# EAGLE schematic ts808 (EAGLE 8.2.0)
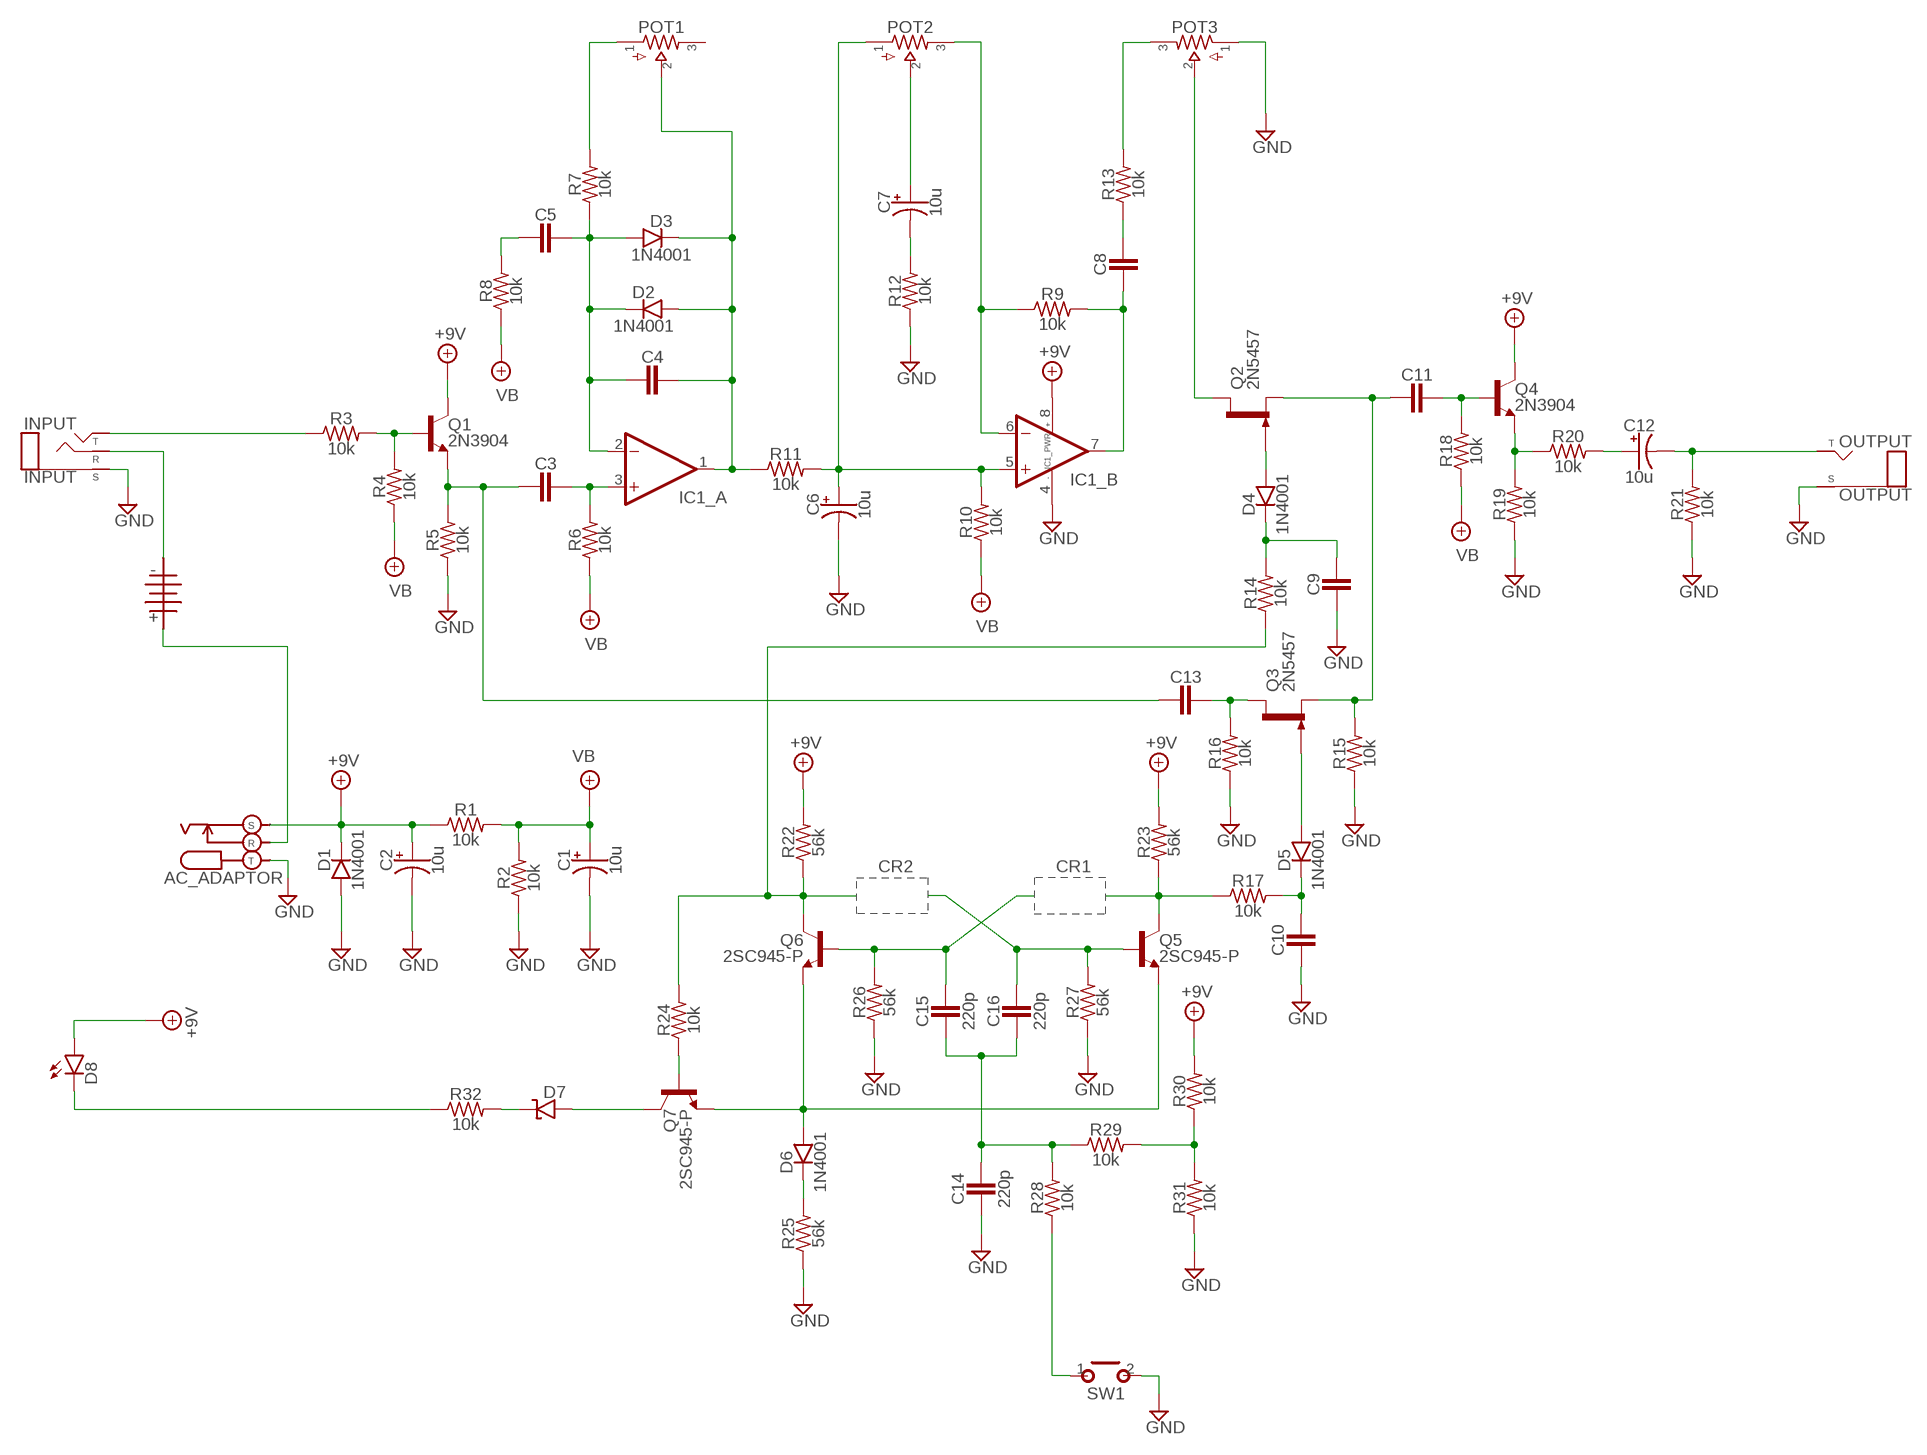
[diagram p0: schematic, sheet 1]

## Parts
AC_ADAPTOR  DCJACK  DC_KOBICONN  [DC_KOBICONN]
BATTERY  BATTERY  [TWO_PADS]
C1  10u  0500  [050_020]
C2  10u  0500  [050_020]
C3  CER/FILMBOX.1  [BOX_SMALL]
C4  CER/FILMBOX.1  [BOX_SMALL]
C5  CER/FILMBOX.1  [BOX_SMALL]
C6  10u  0500  [050_020]
C7  10u  0500  [050_020]
C8  CER/FILMBOX.1  [BOX_SMALL]
C9  CER/FILMBOX.1  [BOX_SMALL]
C10  CER/FILMBOX.1  [BOX_SMALL]
C11  CER/FILMBOX.1  [BOX_SMALL]
C12  10u  0500  [050_020]
C13  CER/FILMBOX.1  [BOX_SMALL]
C14  220p  CER/FILMBOX.1  [BOX_SMALL]
C15  220p  CER/FILMBOX.1  [BOX_SMALL]
C16  220p  CER/FILMBOX.1  [BOX_SMALL]
D1  1N4001  DO35.2  [DO35-2]
D2  1N4001  DO35.2  [DO35-2]
D3  1N4001  DO35.2  [DO35-2]
D4  1N4001  DO35.2  [DO35-2]
D5  1N4001  DO35.2  [DO35-2]
D6  1N4001  DO35.2  [DO35-2]
D7  ZENER.2  [DO41-2]
D8  LED  [3MM_D]
IC1  DUALTH  [DIL0]
INPUT  INPUT  STEREO3PADS  [THREEPADS]
OUTPUT  OUTPUT  MONO  [TWO_PADS]
POT1  POTS16MM  [16MM]
POT2  POTS16MM  [16MM]
POT3  POTS16MM  [16MM]
Q1  2N3904  [TO92-]
Q2  2N5457  [TO92-]
Q3  2N5457  [TO92-]
Q4  2N3904  [TO92-]
Q5  2SC945-P  2SC828A  [TO92-]
Q6  2SC945-P  2SC828A  [TO92-]
Q7  2SC945-P  2SC828A  [TO92-]
R1  10k  R_.3B  [R0207/3]
R2  10k  R_.3B  [R0207/3]
R3  10k  R_.3B  [R0207/3]
R4  10k  R_.3B  [R0207/3]
R5  10k  R_.3B  [R0207/3]
R6  10k  R_.3B  [R0207/3]
R7  10k  R_.3B  [R0207/3]
R8  10k  R_.3B  [R0207/3]
R9  10k  R_.3B  [R0207/3]
R10  10k  R_.3B  [R0207/3]
R11  10k  R_.3B  [R0207/3]
R12  10k  R_.3B  [R0207/3]
R13  10k  R_.3B  [R0207/3]
R14  10k  R_.3B  [R0207/3]
R15  10k  R_.3B  [R0207/3]
R16  10k  R_.3B  [R0207/3]
R17  10k  R_.3B  [R0207/3]
R18  10k  R_.3B  [R0207/3]
R19  10k  R_.3B  [R0207/3]
R20  10k  R_.3B  [R0207/3]
R21  10k  R_.3B  [R0207/3]
R22  56k  R_.3B  [R0207/3]
R23  56k  R_.3B  [R0207/3]
R24  10k  R_.3B  [R0207/3]
R25  56k  R_.3B  [R0207/3]
R26  56k  R_.3B  [R0207/3]
R27  56k  R_.3B  [R0207/3]
R28  10k  R_.3B  [R0207/3]
R29  10k  R_.3B  [R0207/3]
R30  10k  R_.3B  [R0207/3]
R31  10k  R_.3B  [R0207/3]
R32  10k  R_.3B  [R0207/3]
SW1  MOMENTARY  [SPST]

## Nets
+9V: AC_ADAPTOR.S C2.+ D1.C D8.ANODE(A) IC1.8(_PWR:V+) Q1.1(C) Q4.1(C) R1.1 R22.2 R23.2 R30.2
GND: AC_ADAPTOR.T C1.- C2.- C6.- C9.2 C10.2 C14.2 D1.A IC1.4(_PWR:V-) INPUT.SLEEVE(S) OUTPUT.S(SLEEVE) POT3.1 R2.1 R5.1 R12.1 R15.1 R16.1 R19.1 R21.1 R25.1 R26.1 R27.1 R31.1 SW1.2(S)
N$1: INPUT.TIP(T) R3.1
N$2: BATTERY.S INPUT.RING(R)
N$3: Q1.2(B) R3.2 R4.2
N$4: C3.2 C13.2 Q1.3(E) R5.2
N$5: C3.1 IC1.3(_A:+IN) R6.2
N$6: C4.2 C5.1 D2.C D3.A IC1.2(_A:-IN) R7.1
N$7: POT1.1 R7.2
N$8: C4.1 D2.A D3.C IC1.1(_A:OUT) POT1.2 R11.1
N$9: C5.2 R8.2
N$10: C6.+ IC1.5(_B:+IN) POT2.1 R10.2 R11.2
N$11: IC1.6(_B:-IN) POT2.3 R9.1
N$12: C8.2 IC1.7(_B:OUT) R9.2
N$13: C8.1 R13.1
N$14: C7.+ POT2.2
N$15: C7.- R12.2
N$16: POT3.3 R13.2
N$17: POT3.2 Q2.3(D)
N$18: C11.2 Q2.2(S) Q3.2(S) R15.2
N$19: D4.A Q2.1(G)
N$20: C9.1 D4.C R14.2
N$21: D5.A Q3.1(G)
N$22: C10.1 D5.C R17.2
N$23: C11.1 Q4.2(B) R18.2
N$24: Q4.3(E) R19.2 R20.1
N$25: C12.+ R20.2
N$26: C12.- OUTPUT.T(TIP) R21.2
N$27: C13.1 Q3.3(D) R16.2
N$28: AC_ADAPTOR.R BATTERY.T
N$29: Q6.2(C) R14.1 R22.1 R24.2
N$30: Q7.1(B) R24.1
N$31: Q5.2(C) R17.1 R23.1
N$32: C15.1 Q6.1(B) R26.2
N$34: C16.1 Q5.1(B) R27.2
N$35: D6.A Q5.3(E) Q6.3(E) Q7.3(E)
N$36: C14.1 C15.2 C16.2 R28.2 R29.1
N$37: D6.C R25.2
N$38: R29.2 R30.1 R31.2
N$39: R28.1 SW1.1(P)
N$40: D8.P$1(C) R32.1
N$41: D7.C R32.2
N$42: D7.A Q7.2(C)
VB: C1.+ R1.2 R2.2 R4.1 R6.1 R8.1 R10.1 R18.1
Unconnected: POT1.3

## Notes on the sheet
- CR2 | CR1

## Library data of the parts
AC_ADAPTOR = pedals-jacks:DC_KOBICONN
BATTERY = pedals-jacks:BATTERY
C1 C2 C6 C7 C12 = pedals-capacitors-elec:050
C3-C5 C8-C11 C13-C16 = pedals-capacitors-film:CER/FILM: 47 - 120pF Xicon Ceramic Disc 2.5mm lead spacing
D1-D6 = pedals-diodes:DO35: DO-35 Package Diodes: 1N914
D7 = pedals-diodes:ZENER
D8 = pedals-diodes:LED
IC1 = pedals-integrated circuits:DUAL: OP AMP
INPUT = pedals-jacks:STEREO
OUTPUT = pedals-jacks:MONO: Mono 1/4" Phone Jack
POT1-POT3 = pedals-potentiometers:POTS
Q1 Q4 = pedals-transistors:2N3904: NPN Transistor
Q2 Q3 = pedals-transistors:2N5457: N-CHANNEL JFET
Q5-Q7 = pedals-transistors:2SC828A
R1-R32 = pedals-resistors:R_
SW1 = pedals-switches:MOMENTARY